# EAGLE schematic Sensori+Base (EAGLE 7.7.0)
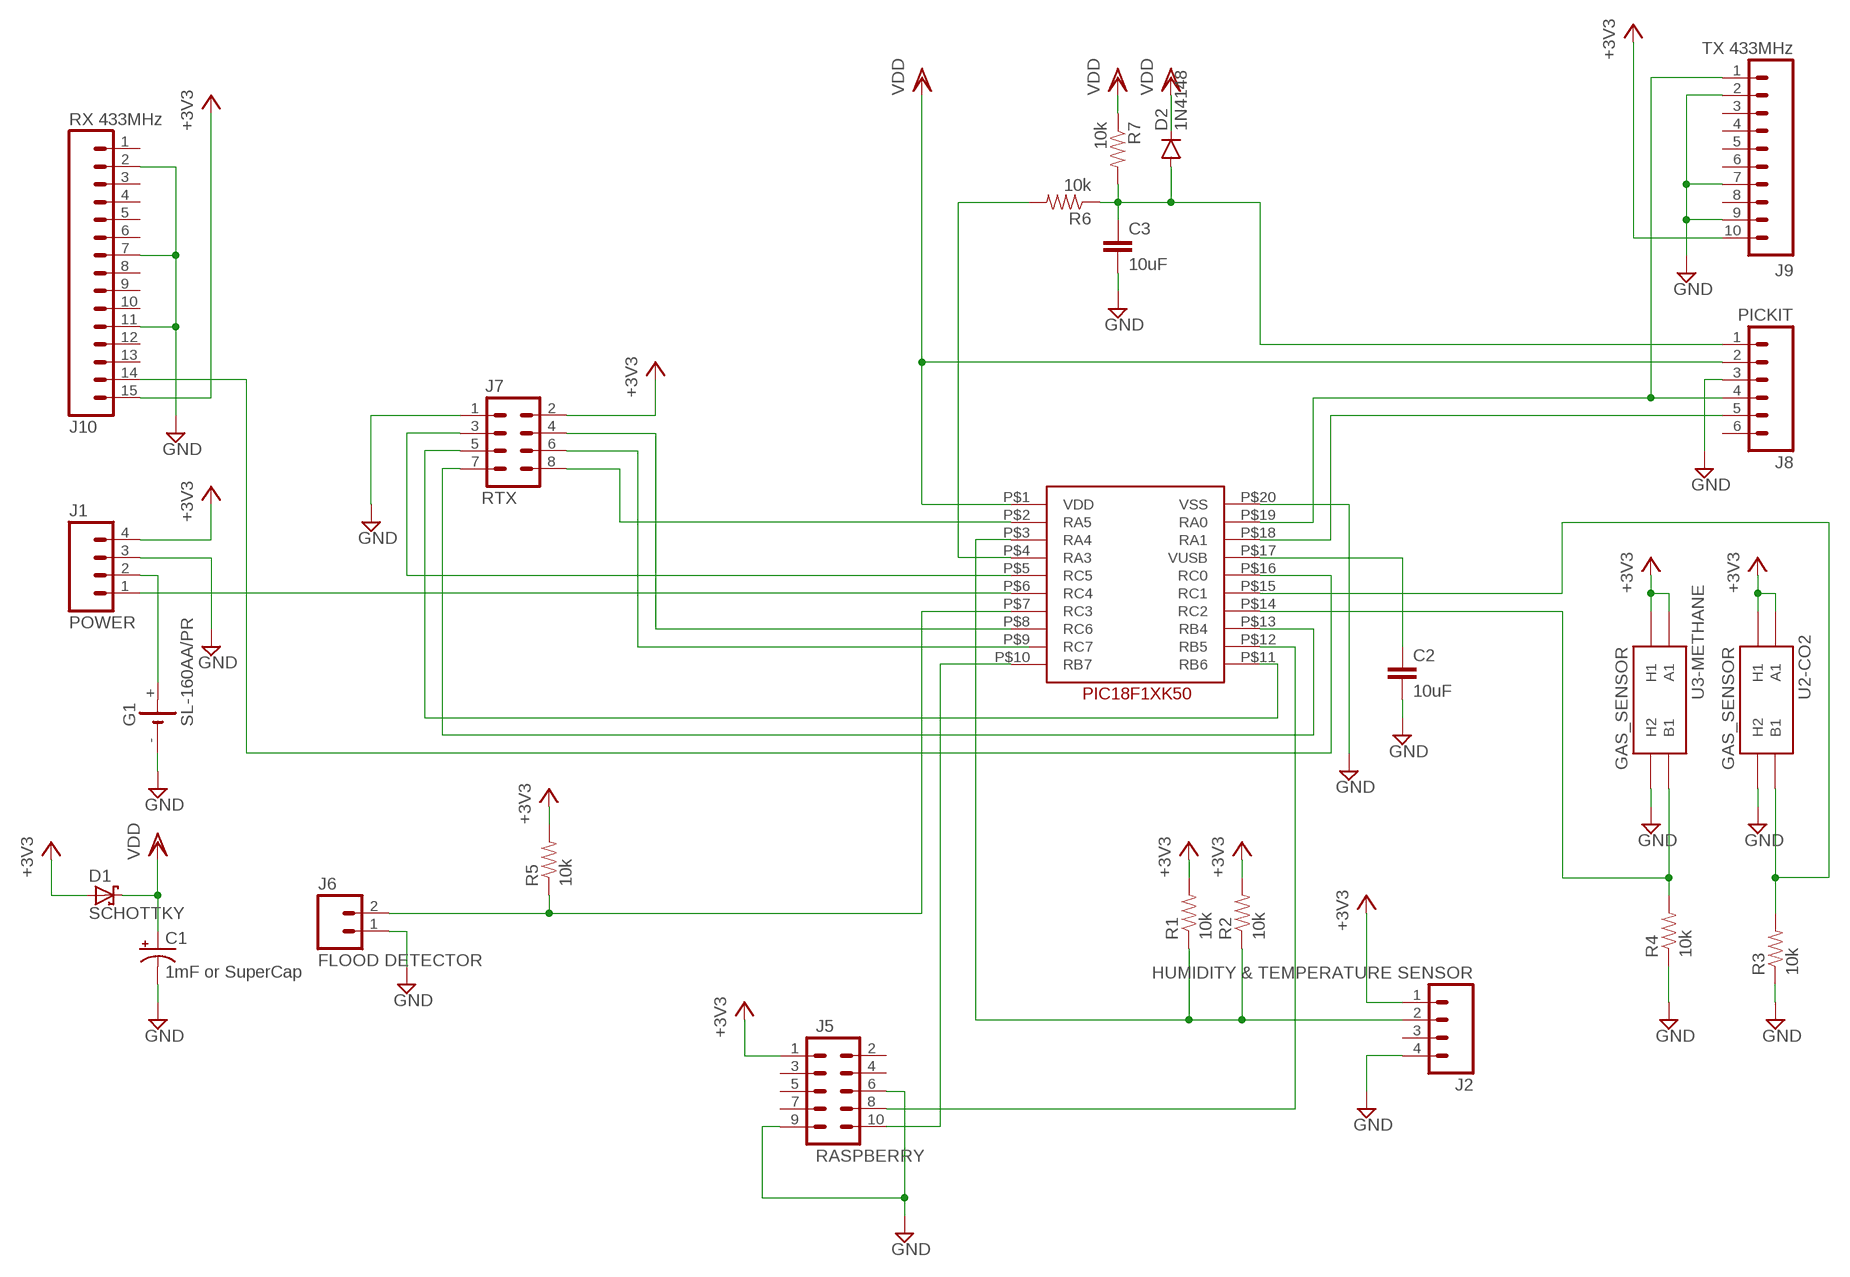
[diagram p0: schematic, sheet 1]

## Parts
C1  1mF or SuperCap  CAP_POLPTH4  [CPOL-RADIAL-1000UF-25V]
C2  10uF  10UF-6.3V-20%(0603)  [0603-CAP]
C3  10uF  10UF-6.3V-20%(0603)  [0603-CAP]
D1  SCHOTTKY  SCHOTTKY-DIODEF126Z12  [F126Z12]
D2  1N4148  DIODE1N4148  [DIODE-1N4148]
G1  SL-160AA/PR  [SL-160AA/PR]
J1  POWER  M04NO_SILK_ALL_ROUND  [1X04_NO_SILK_ALL_ROUND]
J2  HUMIDITY & TEMPERATURE SENSOR  M04NO_SILK_ALL_ROUND  [1X04_NO_SILK_ALL_ROUND]
J5  RASPBERRY  M05X2NO_SILK  [2X5_NOSILK]
J6  FLOOD DETECTOR  M021X02_NO_SILK  [1X02_NO_SILK]
J7  RTX  M04X2  [2X4]
J8  PICKIT  M06NO_SILK_FEMALE_PTH  [1X06_NO_SILK]
J9  TX 433MHz  M10NO_SILK_PTH_FEMALE  [1X10_NO_SILK]
J10  RX 433MHz  M15  [1X15]
R1  10k  RESISTOREZ  [AXIAL-0.3EZ]
R2  10k  RESISTOREZ  [AXIAL-0.3EZ]
R3  10k  RESISTOREZ  [AXIAL-0.3EZ]
R4  10k  RESISTOREZ  [AXIAL-0.3EZ]
R5  10k  RESISTOREZ  [AXIAL-0.3EZ]
R6  10k  RESISTOREZ  [AXIAL-0.3EZ]
R7  10k  RESISTOREZ  [AXIAL-0.3EZ]
U2-CO2  GAS_SENSOR  [MQ-3]
U3-METHANE  GAS_SENSOR  [MQ-3]
U$1  PIC18F1XK50  [SPDIP-20PIN]

## Nets
+3V3: D1.A J1.4 J2.1 J5.1 J7.2 J9.10 J10.15 R1.P$2 R2.P$2 R5.P$2 U2-CO2.A1 U2-CO2.HA(H1) U3-METHANE.A1 U3-METHANE.HA(H1)
GND: C1.2(-) C2.2 C3.2 G1.- J1.3 J2.4 J5.6 J5.9 J6.1 J7.1 J8.3 J9.2 J9.7 J9.9 J10.2 J10.7 J10.11 R3.P$1 R4.P$1 U2-CO2.HB(H2) U3-METHANE.HB(H2) U$1.P$20(VSS)
N$1: J7.3 U$1.P$5(RC5)
N$2: J7.4 U$1.P$8(RC6)
N$3: J7.5 U$1.P$11(RB6)
N$4: J7.6
N$5: J7.7 U$1.P$13(RB4)
N$6: J7.8 U$1.P$2(RA5)
N$7: J1.1 U$1.P$6(RC4)
N$8: G1.+ J1.2
N$9: J2.2 R1.P$1 R2.P$1 U$1.P$3(RA4)
N$10: R4.P$2 U3-METHANE.B1 U$1.P$14(RC2)
N$11: R3.P$2 U2-CO2.B1 U$1.P$15(RC1)
N$12: J5.10 U$1.P$10(RB7)
N$13: J5.8 U$1.P$12(RB5)
N$14: J6.2 R5.P$1 U$1.P$7(RC3)
N$15: R6.P$2 U$1.P$4(RA3)
N$16: J8.4 J9.1 U$1.P$19(RA0)
N$17: J8.5 U$1.P$18(RA1)
N$18: C2.1 U$1.P$17(VUSB)
N$19: C3.1 D2.A J8.1 R6.P$1 R7.P$2
N$20: J10.14 U$1.P$16(RC0)
VDD: C1.1(+) D1.C D2.C J8.2 R7.P$1 U$1.P$1(VDD)
Unconnected: J2.3 J5.2 J5.3 J5.4 J5.5 J5.7 J8.6 J9.3 J9.4 J9.5 J9.6 J9.8 J10.1 J10.3 J10.4 J10.5 J10.6 J10.8 J10.9 J10.10 J10.12 J10.13 U$1.P$9(RC7)

## Library data of the parts
C1 = SparkFun-Passives:CAP_POL: Capacitor Polarized These are standard SMD and PTH capacitors. Normally 10uF, 47uF, and 100uF in electrolytic and tantalum varieties. Always verify the external diameter of the through hole cap, it varies with capacity, voltage, and manufacturer. The EIA devices should be standard.
C2 C3 = SparkFun-Capacitors:10UF-6.3V-20%(0603): CAP-11015; PROD_ID: CAP-11015
D1 = diode:SCHOTTKY-DIODE: Schottky Diode
D2 = SparkFun-DiscreteSemi:DIODE: Diode These are standard reverse protection diodes and small signal diodes. SMA package can handle up to about 1A. SOD-323 can handle about 200mA. What the SOD-323 package when ordering, there are some mfgs out there that are 5-pin packages.; PROD_ID: DIO-08378
G1 = battery:SL-160AA/PR: LI BATTERY Sonnenschein
J1 J2 = SparkFun-Connectors:M04: Header 4 Standard 4-pin 0.1" header. Use with straight break away headers (SKU : PRT-00116), right angle break away headers (PRT-00553), swiss pins (PRT-00743), machine pins (PRT-00117), and female headers (PRT-00115). Molex polarized connector foot print use with SKU : PRT-08231 with associated crimp pins and housings. 1MM SMD Version SKU: PRT-10208; PROD_ID: CONN-09696
J5 = SparkFun-Connectors:M05X2: Header 5x2 Standard 10-pin dual row 0.1" header. Commonly used with AVR-ISP. Use with Spark Fun Electronics SKU: PRT-00778
J6 = SparkFun-Connectors:M02: Standard 2-pin 0.1" header. Use with - straight break away headers ( PRT-00116) - right angle break away headers (PRT-00553) - swiss pins (PRT-00743) - machine pins (PRT-00117) - female headers (PRT-00115) Molex polarized connector foot print use with: PRT-08233 with associated crimp pins and housings. 2.54_SCREWTERM for use with PRT-10571. 3.5mm Screw Terminal footprints for PRT-08084 5mm Screw Terminal footprints for use with PRT-08432
J7 = SparkFun-Connectors:M04X2: .1" header, two rows of four.
J8 = SparkFun-Connectors:M06: Header 6 Standard 6-pin 0.1" header. Use with straight break away headers (SKU : PRT-00116), right angle break away headers (PRT-00553), swiss pins (PRT-00743), machine pins (PRT-00117), and female headers (PRT-00115). Molex polarized connector foot print use with SKU : PRT-08094 with associated crimp pins and housings. NOTES ON THE VARIANTS LOCK and LOCK_LONGPADS... This footprint was designed to help hold the alignment of a through-hole component (i.e. 6-pin header) while soldering it into place. You may notice that each hole has been shifted either up or down by 0.005 of an inch from it's more standard position (which is a perfectly straight line). This slight alteration caused the pins (the squares in the middle) to touch the edges of the holes. Because they are alternating, it causes a "brace" to hold the component in place. 0.005 has proven to be the perfect amount of "off-center" position when using our standard breakaway headers. Although looks a little odd when you look at the bare footprint, once you have a header in there, the alteration is very hard to notice. Also,if you push a header all the way into place, it is covered up entirely on the bottom side. This idea of altering the position of holes to aid alignment will be further integrated into the Sparkfun Library for other footprints. It can help hold any component with 3 or more connection pins.; PROD_ID: CONN-08437
J9 = SparkFun-Connectors:M10: Header 10 Standard 10-pin 0.1" header. Use with straight break away headers (SKU : PRT-00116), right angle break away headers (PRT-00553), swiss pins (PRT-00743), machine pins (PRT-00117), and female headers (PRT-00115).; PROD_ID: CONN-11563
J10 = SparkFun-Connectors:M15: Header 15 Standard 15-pin 0.1" header. Use with straight break away headers (SKU : PRT-00116), right angle break away headers (PRT-00553), swiss pins (PRT-00743), machine pins (PRT-00117), and female headers (PRT-00115).
R1-R7 = SparkFun-Passives:RESISTOR: Resistor Basic schematic elements and footprints for 0603, 1206, and PTH resistors.
U2-CO2 U3-METHANE = SparkFun-Sensors:GAS_SENSOR: MQ-3 alcohol gas sensor . FP not tested. SEN-08880.
U$1 = Luca:PIC18F1XK50